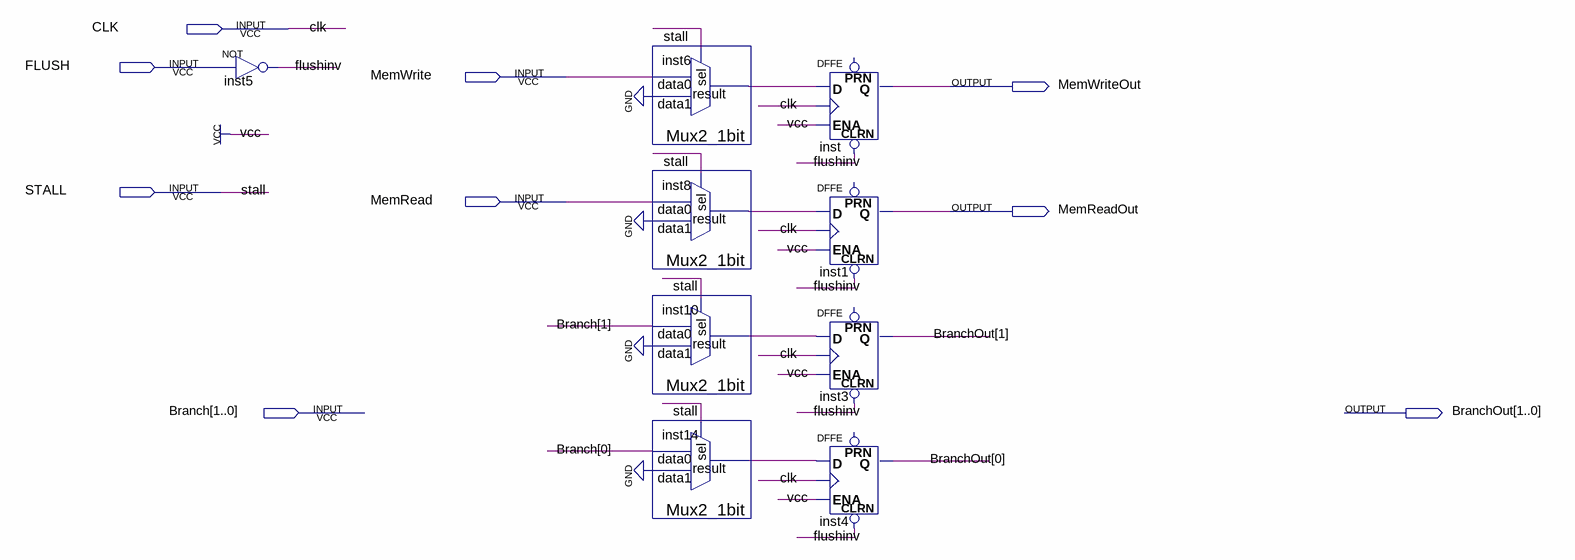
[diagram p0: schematic sheet]
// Quartus schematic MWPipe.bdf as structural Verilog: 9 symbols, 9 pins
module MWPipe (
  input  CLK,
  input  FLUSH,
  input  MemWrite,
  input  STALL,
  input  MemRead,
  input  [1:0] Branch,
  output MemWriteOut,
  output MemReadOut,
  output [1:0] BranchOut
);

  wire flushinv, inst6_result, inst8_result, inst10_result, inst14_result;

  not inst5 (flushinv, FLUSH);
  Mux2_1bit inst6 (.data1(1'b0), .data0(MemWrite), .sel(STALL), .result(inst6_result));
  Mux2_1bit inst8 (.data1(1'b0), .data0(MemRead), .sel(STALL), .result(inst8_result));
  Mux2_1bit inst10 (.data1(1'b0), .data0(Branch[1]), .sel(STALL), .result(inst10_result));
  Mux2_1bit inst14 (.data1(1'b0), .data0(Branch[0]), .sel(STALL), .result(inst14_result));
  DFFE inst (.CLRN(flushinv), .D(inst6_result), .CLK(CLK), .ENA(1'b1), .Q(MemWriteOut));  // open: PRN
  DFFE inst1 (.CLRN(flushinv), .D(inst8_result), .CLK(CLK), .ENA(1'b1), .Q(MemReadOut));  // open: PRN
  DFFE inst3 (.CLRN(flushinv), .D(inst10_result), .CLK(CLK), .ENA(1'b1), .Q(BranchOut[1]));  // open: PRN
  DFFE inst4 (.CLRN(flushinv), .D(inst14_result), .CLK(CLK), .ENA(1'b1), .Q(BranchOut[0]));  // open: PRN
endmodule
